# Altium schematic sheet CAR ALARM_UNIT.SchDoc
size A3
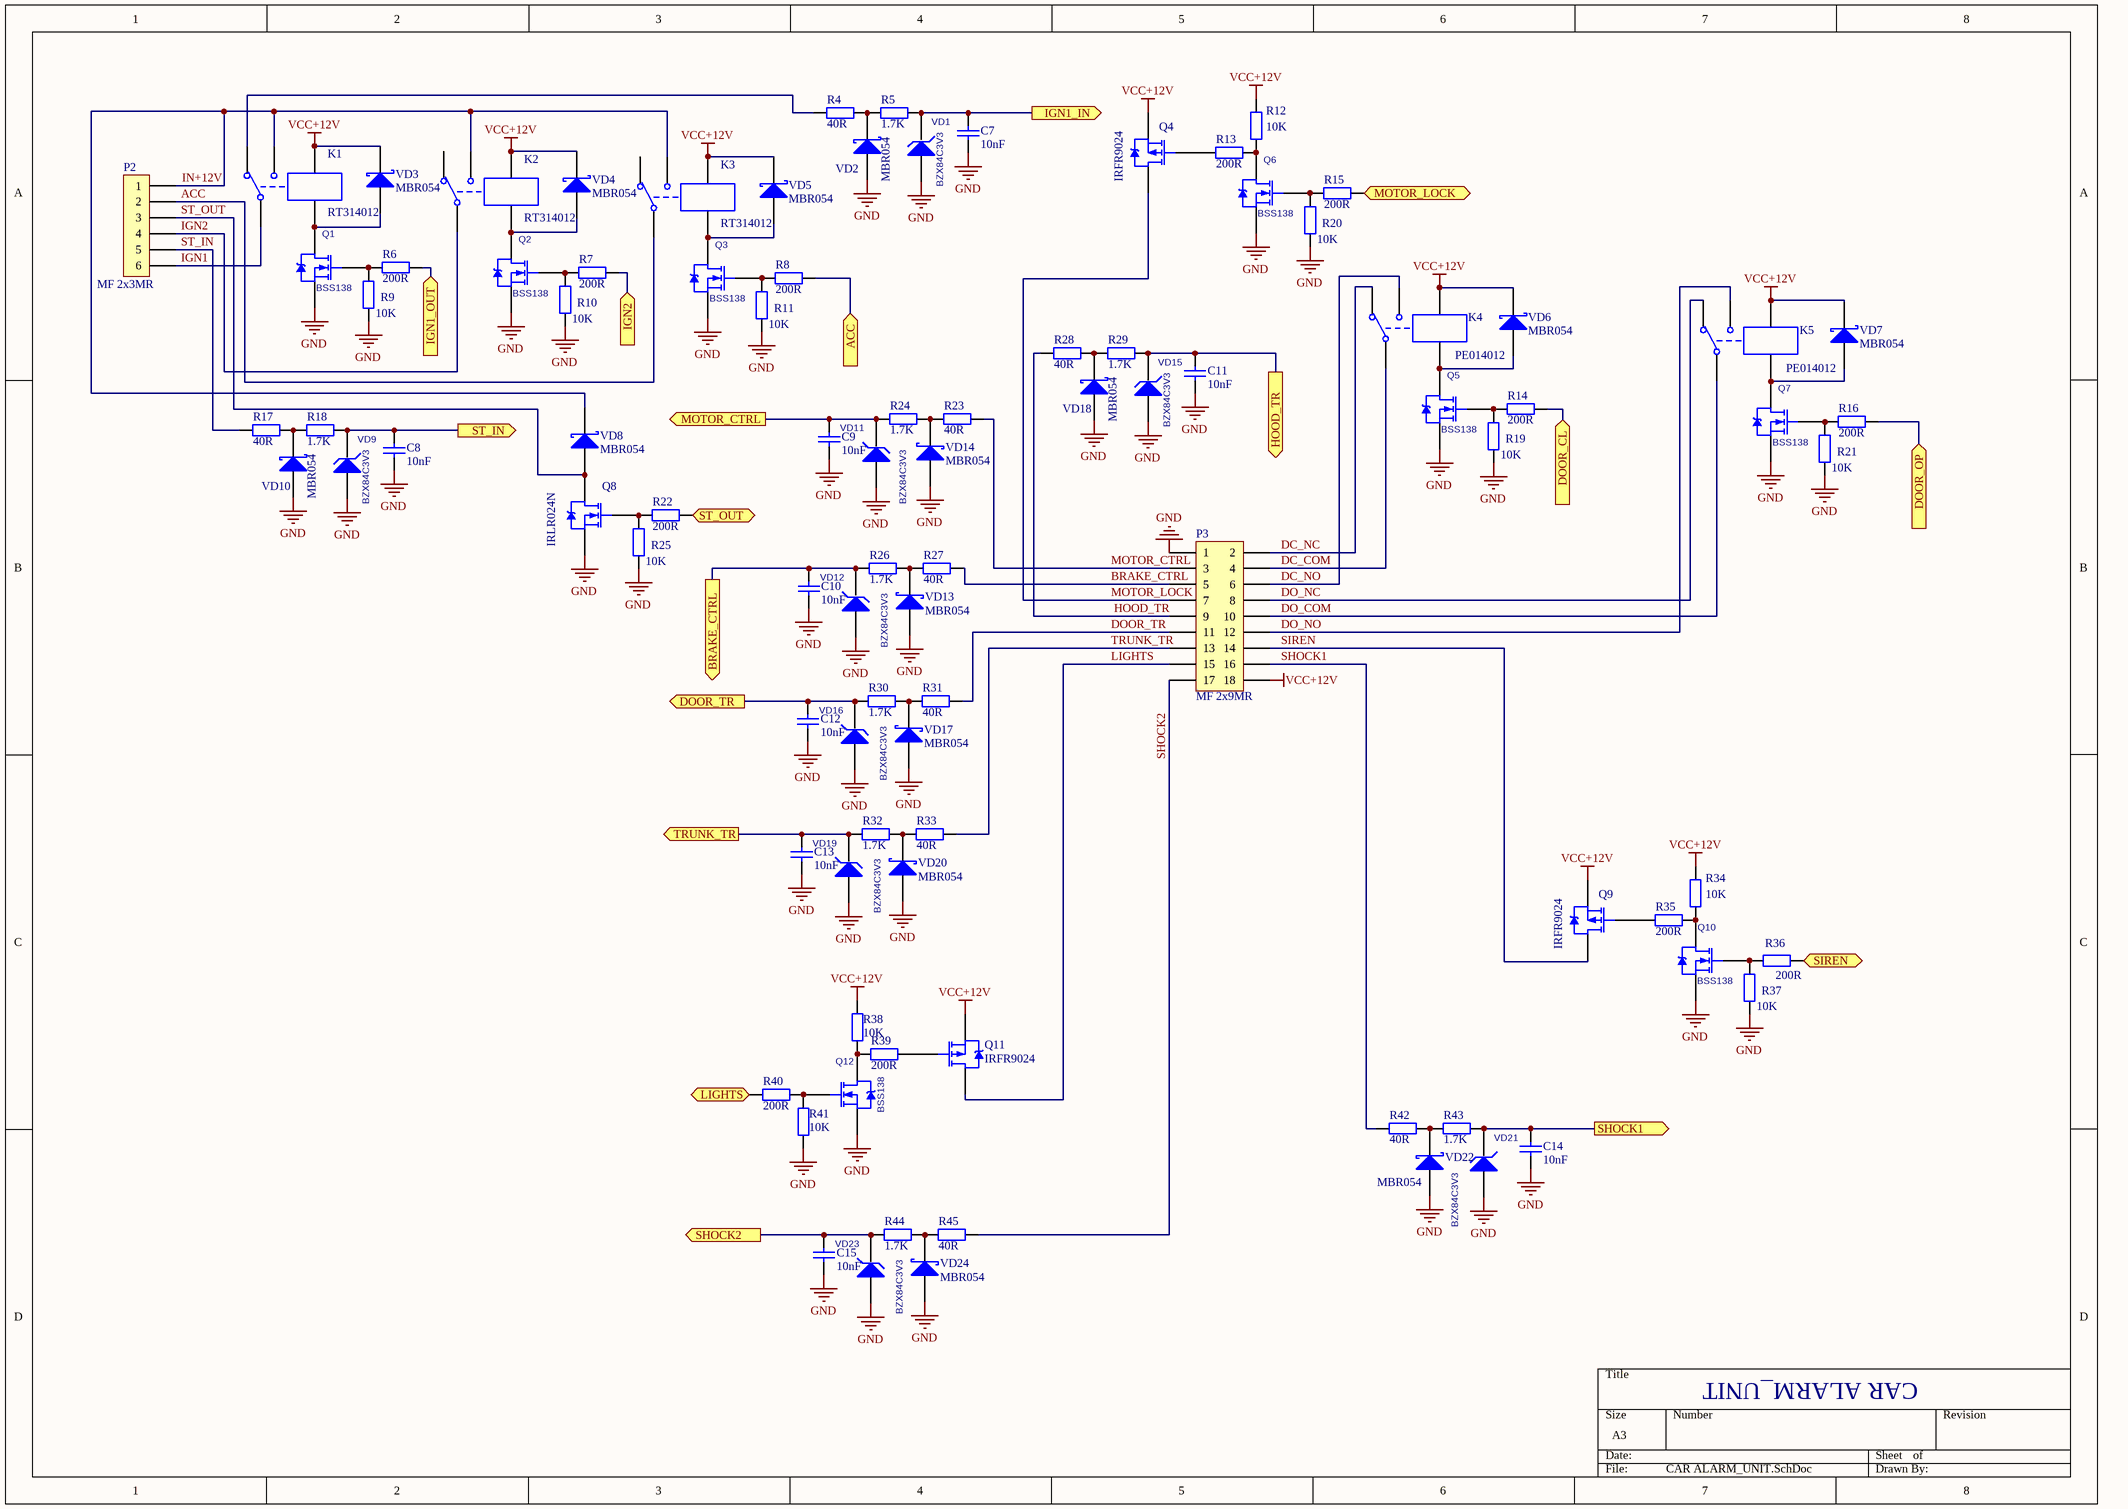
[diagram p0: CAR ALARM_UNIT.SchDoc]

## Parts
C7  value 10nF  [C0603]  (hidden comment: 0805)
C8  value 10nF  [C0603]  (hidden comment: 0805)
C9  value 10nF  [C0603]  (hidden comment: 0805)
C10  value 10nF  [C0603]  (hidden comment: 0805)
C11  value 10nF  [C0603]  (hidden comment: 0805)
C12  value 10nF  [C0603]  (hidden comment: 0805)
C13  value 10nF  [C0603]  (hidden comment: 0805)
C14  value 10nF  [C0603]  (hidden comment: 0805)
C15  value 10nF  [C0603]  (hidden comment: 0805)
K1  RT314012  [RT314012]
K2  RT314012  [RT314012]
K3  RT314012  [RT314012]
K4  PE014012  [PE014012]
K5  PE014012  [PE014012]
P2  MF 2x3MR  [MF 2x3MR]
P3  MF 2x9MR  [MF 2x9MR]
Q1  BSS138  [SOT23]
Q2  BSS138  [SOT23]
Q3  BSS138  [SOT23]
Q4  IRFR9024  [TO-252AA_M]
Q5  BSS138  [SOT23]
Q6  BSS138  [SOT23]
Q7  BSS138  [SOT23]
Q8  IRLR024N  [TO-252AA_M]
Q9  IRFR9024  [TO-252AA_M]
Q10  BSS138  [SOT23]
Q11  IRFR9024  [TO-252AA_M]
Q12  BSS138  [SOT23]
R4  value 40R  [C0805]  (hidden comment: RES)
R5  value 1.7K  [C0805]  (hidden comment: RES)
R6  value 200R  [C0603]  (hidden comment: RES)
R7  value 200R  [C0603]  (hidden comment: RES)
R8  value 200R  [C0603]  (hidden comment: RES)
R9  value 10K  [C0603]  (hidden comment: RES)
R10  value 10K  [C0603]  (hidden comment: RES)
R11  value 10K  [C0603]  (hidden comment: RES)
R12  value 10K  [C0805]  (hidden comment: RES)
R13  value 200R  [C0805]  (hidden comment: RES)
R14  value 200R  [C0603]  (hidden comment: RES)
R15  value 200R  [C0603]  (hidden comment: RES)
R16  value 200R  [C0603]  (hidden comment: RES)
R17  value 40R  [C0805]  (hidden comment: RES)
R18  value 1.7K  [C0805]  (hidden comment: RES)
R19  value 10K  [C0603]  (hidden comment: RES)
R20  value 10K  [C0603]  (hidden comment: RES)
R21  value 10K  [C0603]  (hidden comment: RES)
R22  value 200R  [C0805]  (hidden comment: RES)
R23  value 40R  [C0805]  (hidden comment: RES)
R24  value 1.7K  [C0805]  (hidden comment: RES)
R25  value 10K  [C0805]  (hidden comment: RES)
R26  value 1.7K  [C0805]  (hidden comment: RES)
R27  value 40R  [C0805]  (hidden comment: RES)
R28  value 40R  [C0805]  (hidden comment: RES)
R29  value 1.7K  [C0805]  (hidden comment: RES)
R30  value 1.7K  [C0805]  (hidden comment: RES)
R31  value 40R  [C0805]  (hidden comment: RES)
R32  value 1.7K  [C0805]  (hidden comment: RES)
R33  value 40R  [C0805]  (hidden comment: RES)
R34  value 10K  [C0805]  (hidden comment: RES)
R35  value 200R  [C0805]  (hidden comment: RES)
R36  value 200R  [C0603]  (hidden comment: RES)
R37  value 10K  [C0603]  (hidden comment: RES)
R38  value 10K  [C0805]  (hidden comment: RES)
R39  value 200R  [C0805]  (hidden comment: RES)
R40  value 200R  [C0603]  (hidden comment: RES)
R41  value 10K  [C0603]  (hidden comment: RES)
R42  value 40R  [C0805]  (hidden comment: RES)
R43  value 1.7K  [C0805]  (hidden comment: RES)
R44  value 1.7K  [C0805]  (hidden comment: RES)
R45  value 40R  [C0805]  (hidden comment: RES)
VD1  BZX84C3V3  [SOT23]
VD2  MBR054  [SOD-123]
VD3  MBR054  [SOD-123]
VD4  MBR054  [SOD-123]
VD5  MBR054  [SOD-123]
VD6  MBR054  [SOD-123]
VD7  MBR054  [SOD-123]
VD8  MBR054  [SOD-123]
VD9  BZX84C3V3  [SOT23]
VD10  MBR054  [SOD-123]
VD11  BZX84C3V3  [SOT23]
VD12  BZX84C3V3  [SOT23]
VD13  MBR054  [SOD-123]
VD14  MBR054  [SOD-123]
VD15  BZX84C3V3  [SOT23]
VD16  BZX84C3V3  [SOT23]
VD17  MBR054  [SOD-123]
VD18  MBR054  [SOD-123]
VD19  BZX84C3V3  [SOT23]
VD20  MBR054  [SOD-123]
VD21  BZX84C3V3  [SOT23]
VD22  MBR054  [SOD-123]
VD23  BZX84C3V3  [SOT23]
VD24  MBR054  [SOD-123]

## Ports
ACC (in), BRAKE_CTRL (out), DOOR_CL (in), DOOR_OP (in), DOOR_TR (out), HOOD_TR (out), IGN1_IN (out), IGN1_OUT (in), IGN2 (in), LIGHTS (in), MOTOR_CTRL (out), MOTOR_LOCK (in), SHOCK1 (out), SHOCK2 (out), SIREN (in), ST_IN (out), ST_OUT (in), TRUNK_TR (out)

## Nets
GND: C7.2 C8.2 C9.2 C10.2 C11.2 C12.2 C13.2 C14.2 C15.2 P3.1 Q1.2(S) Q2.2(S) Q3.2(S) Q5.2(S) Q6.2(S) Q7.2(S) Q8.3(S) Q10.2(S) Q12.2(S) R9.1 R10.1 R11.1 R19.1 R20.1 R21.1 R25.1 R37.1 R41.1 VD1.1(A) VD2.2(A) VD9.1(A) VD10.2(A) VD11.1(A) VD12.1(A) VD13.2(A) VD14.2(A) VD15.1(A) VD16.1(A) VD17.2(A) VD18.2(A) VD19.1(A) VD20.2(A) VD21.1(A) VD22.2(A) VD23.1(A) VD24.2(A)
VCC+12V: K1.2 K2.2 K3.2 K4.2 K5.2 P3.18 Q4.3(S) Q9.3(S) Q11.3(S) R12.2 R34.2 R38.2 VD3.1(K) VD4.1(K) VD5.1(K) VD6.1(K) VD7.1(K)
ACC: K3.3 P2.2
ACC: R8.2 ; port ACC  [a separate net that carries the same name]
BRAKE_CTRL: P3.5 R27.1
BRAKE_CTRL: C10.1 R26.2 VD12.3(K) ; port BRAKE_CTRL  [a separate net that carries the same name]
DC_COM: K4.3 P3.4
DC_NC: K4.4 P3.2
DC_NO: K4.5 P3.6
DO_COM: K5.3 P3.10
DO_NC: K5.4 P3.8
DO_NO: K5.5 P3.12
DOOR_CL: R14.2 ; port DOOR_CL
DOOR_OP: R16.2 ; port DOOR_OP
DOOR_TR: P3.11 R31.1
DOOR_TR: C12.1 R30.2 VD16.3(K) ; port DOOR_TR  [a separate net that carries the same name]
HOOD_TR: P3.9 R28.1
HOOD_TR: C11.1 R29.2 VD15.3(K) ; port HOOD_TR  [a separate net that carries the same name]
IGN1: K1.3 P2.6
IGN1_IN: C7.1 R5.2 VD1.3(K) ; port IGN1_IN
IGN1_OUT: R6.2 ; port IGN1_OUT
IGN2: K2.3 P2.4
IGN2: R7.2 ; port IGN2  [a separate net that carries the same name]
IN+12V: K1.5 K2.5 K3.5 P2.1 VD8.1(K)
LIGHTS: P3.15 Q11.4(D)
LIGHTS: R40.2 ; port LIGHTS  [a separate net that carries the same name]
MOTOR_CTRL: P3.3 R23.1
MOTOR_CTRL: C9.1 R24.2 VD11.3(K) ; port MOTOR_CTRL  [a separate net that carries the same name]
MOTOR_LOCK: P3.7 Q4.4(D)
MOTOR_LOCK: R15.2 ; port MOTOR_LOCK  [a separate net that carries the same name]
SHOCK1: P3.16 R42.1
SHOCK1: C14.1 R43.2 VD21.3(K) ; port SHOCK1  [a separate net that carries the same name]
SHOCK2: P3.17 R45.1
SHOCK2: C15.1 R44.2 VD23.3(K) ; port SHOCK2  [a separate net that carries the same name]
SIREN: P3.14 Q9.4(D)
SIREN: R36.2 ; port SIREN  [a separate net that carries the same name]
ST_IN: P2.5 R17.1
ST_IN: C8.1 R18.2 VD9.3(K) ; port ST_IN  [a separate net that carries the same name]
ST_OUT: P2.3 Q8.4(D) VD8.2(A)
ST_OUT: R22.2 ; port ST_OUT  [a separate net that carries the same name]
TRUNK_TR: P3.13 R33.1
TRUNK_TR: C13.1 R32.2 VD19.3(K) ; port TRUNK_TR  [a separate net that carries the same name]
NetK1_1: K1.1 Q1.3(D) VD3.2(A)
NetK1_4: K1.4 R4.1
NetK2_1: K2.1 Q2.3(D) VD4.2(A)
NetK3_1: K3.1 Q3.3(D) VD5.2(A)
NetK4_1: K4.1 Q5.3(D) VD6.2(A)
NetK5_1: K5.1 Q7.3(D) VD7.2(A)
NetQ1_1: Q1.1(G) R6.1 R9.2
NetQ2_1: Q2.1(G) R7.1 R10.2
NetQ3_1: Q3.1(G) R8.1 R11.2
NetQ4_1: Q4.1(G) R13.1
NetQ5_1: Q5.1(G) R14.1 R19.2
NetQ6_1: Q6.1(G) R15.1 R20.2
NetQ6_3: Q6.3(D) R12.1 R13.2
NetQ7_1: Q7.1(G) R16.1 R21.2
NetQ8_1: Q8.1(G) R22.1 R25.2
NetQ9_1: Q9.1(G) R35.1
NetQ10_1: Q10.1(G) R36.1 R37.2
NetQ10_3: Q10.3(D) R34.1 R35.2
NetQ11_1: Q11.1(G) R39.1
NetQ12_1: Q12.1(G) R40.1 R41.2
NetQ12_3: Q12.3(D) R38.1 R39.2
NetR4_2: R4.2 R5.1 VD2.1(K)
NetR17_2: R17.2 R18.1 VD10.1(K)
NetR23_2: R23.2 R24.1 VD14.1(K)
NetR26_1: R26.1 R27.2 VD13.1(K)
NetR28_2: R28.2 R29.1 VD18.1(K)
NetR30_1: R30.1 R31.2 VD17.1(K)
NetR32_1: R32.1 R33.2 VD20.1(K)
NetR42_2: R42.2 R43.1 VD22.1(K)
NetR44_1: R44.1 R45.2 VD24.1(K)

Not connected (* = marked no-connect by the designer): K2 4; K3 4; VD1 2; VD9 2; VD11 2; VD12 2; VD15 2; VD16 2; VD19 2; VD21 2; VD23 2

## Notes on the sheet
- CAR ALARM_UNIT

## Library data of the parts
C7-C15 = Capasitor_SMD_0805: Capasitor_SMD_0808/
Q1-Q3 Q5-Q7 Q10 Q12 = BSS138-SOT23
Q4 Q9 Q11 = IRFR9024: HEXFET Power MOSFET; Note: Pin 2 is trimmed and is electrically connected to Drain.; Published: 8-Jun-2000; LatestRevisionDate: 20-Nov-2009; LatestRevisionNote: IPC-7351 Footprint Added.; DatasheetVersion: PD-9.655A; PackageVersion: Feb-2003; PackageReference: TO-252AA; Publisher: Altium Limited; PackageDescription: 3-Pin HEXFET Package 2.28 mm Pitch, 9.9 mm Lead Span; Code_JEDEC: TO-252-AA; ComponentLink1Description: Manufacturer Link; ComponentLink1URL: http://www.irf.com/; ComponentLink2Description: Datasheet; ComponentLink2URL: http://www.irf.com/product-info/datasheets/data/irfr9024.pdf
Q8 = IRLR024N: HEXFET Power MOSFET; Note: Pin 2 is trimmed and is electrically connected to Drain.; Published: 8-Jun-2000; LatestRevisionDate: 20-Nov-2009; LatestRevisionNote: IPC-7351 Footprint Added.; PackageVersion: Feb-2003; PackageReference: TO-252AA; Publisher: Altium Limited; PackageDescription: 3-Pin HEXFET Package 2.28 mm Pitch, 9.9 mm Lead Span; Code_JEDEC: TO-252-AA; ComponentLink1Description: Manufacturer Link; ComponentLink1URL: http://www.irf.com/; ComponentLink2Description: Datasheet; ComponentLink2URL: http://www.irf.com/product-info/datasheets/data/irlr024n.pdf
R4-R45 = RES: Resistor
VD1 VD9 VD11 VD12 VD15 VD16 VD19 VD21 VD23 = BZX84C: Value: *